# Altium schematic sheet ISO_CAN2.SchDoc
size A4; SheetNumber: 5; SheetTotal: 6
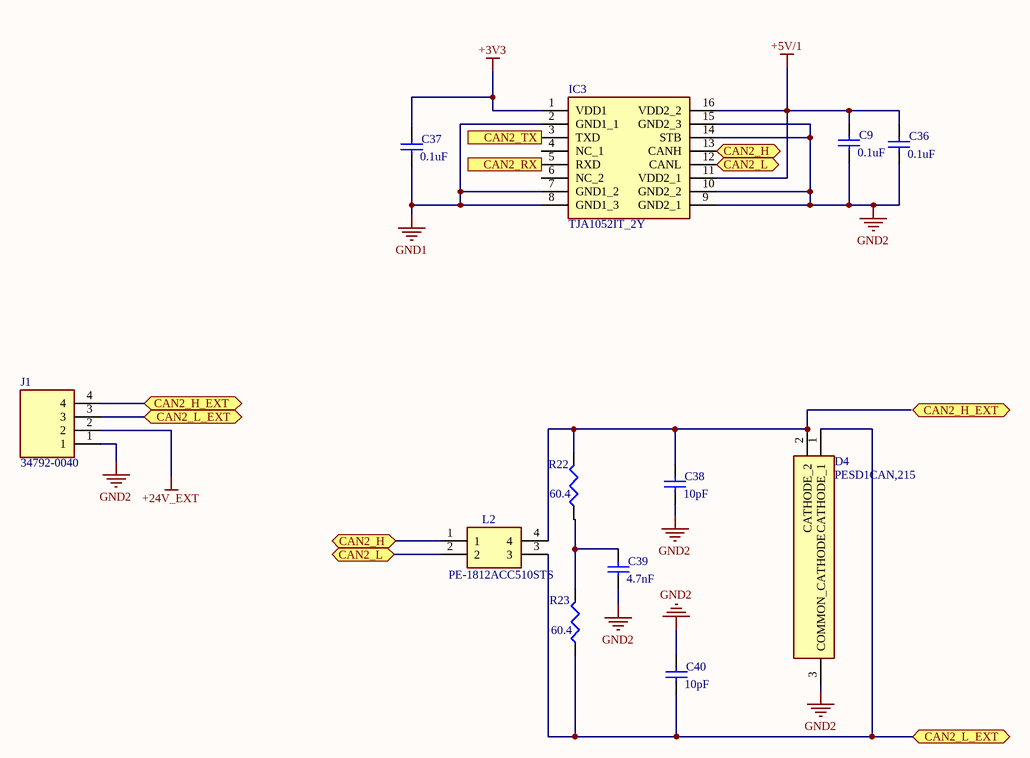
[diagram p0: ISO_CAN2.SchDoc]

## Parts
C9  value 0.1uF  [1608[0603]]  (hidden comment: Cap Semi)
C36  value 0.1uF  [1608[0603]]  (hidden comment: Cap Semi)
C37  value 0.1uF  [1608[0603]]  (hidden comment: Cap Semi)
C38  value 10pF  [1608[0603]]  (hidden comment: Cap Semi)
C39  value 4.7nF  [1608[0603]]  (hidden comment: Cap Semi)
C40  value 10pF  [1608[0603]]  (hidden comment: Cap Semi)
D4  PESD1CAN,215  [SOT95P230X110-3N]
IC3  TJA1052IT_2Y  [SOIC127P1032X265-16N]
J1  34792-0040  [347920040]
L2  PE-1812ACC510STS  [PE1812ACC510STS]
R22  value 60.4  [J1-0603]  (hidden comment: Res3)
R23  value 60.4  [J1-0603]  (hidden comment: Res3)

## Ports
CAN2_H (bidir), CAN2_H_EXT (bidir), CAN2_L (bidir), CAN2_L_EXT (bidir), CAN2_RX (out), CAN2_TX (in)

## Nets
+3V3: C37.2 IC3.1(VDD1)
+5V/1: C9.2 C36.2 IC3.11(VDD2_1) IC3.16(VDD2_2)
+24V_EXT: J1.2
GND1: C37.1 IC3.2(GND1_1) IC3.7(GND1_2) IC3.8(GND1_3)
GND2: C9.1 C36.1 C38.1 C39.1 C40.2 D4.3(COMMON_CATHODE) IC3.9(GND2_1) IC3.10(GND2_2) IC3.14(STB) IC3.15(GND2_3) J1.1
CAN2_H: IC3.13(CANH) L2.1 ; port CAN2_H
CAN2_H_EXT: J1.4 ; port CAN2_H_EXT
CAN2_L: IC3.12(CANL) L2.2 ; port CAN2_L
CAN2_L_EXT: C40.1 D4.1(CATHODE_1) J1.3 L2.3 R23.1 ; port CAN2_L_EXT
CAN2_RX: IC3.5(RXD) ; port CAN2_RX
CAN2_TX: IC3.3(TXD) ; port CAN2_TX
NetC38_2: C38.2 D4.2(CATHODE_2) L2.4 R22.2
NetC39_2: C39.2 R22.1 R23.2

Not connected (* = marked no-connect by the designer): IC3 4(NC_1) 6(NC_2)

## Library data of the parts
C9 C36-C40 = Cap Semi: Capacitor (Semiconductor SIM Model); Published: 8-Jun-2000; LatestRevisionDate: 29-May-2009; LatestRevisionNote: IPC-7351 Footprint Added.; PackageReference: C1206; Publisher: Altium Limited; PackageDescription: Chip Capacitor
D4 = PESD1CAN,215: Diode ESD (Uni-directional); Manufacturer_Name: Nexperia; Datasheet Link: https://assets.nexperia.com/documents/data-sheet/PESD1CAN.pdf; Height: 1.1mm; Manufacturer_Part_Number: PESD1CAN,215; Mouser Part Number: 771-PESD1CAN-T/R; Mouser Price/Stock: https://www.mouser.co.uk/ProductDetail/Nexperia/PESD1CAN215?qs=LOCUfHb8d9vzREMT8aTFcw%3D%3D; Arrow Part Number: PESD1CAN,215; Arrow Price/Stock: https://www.arrow.com/en/products/pesd1can215/nexperia
IC3 = TJA1052IT_2Y: Integrated Circuit; Manufacturer_Name: NXP; Manufacturer_Part_Number: TJA1052IT/2Y; Datasheet Link: http://www.nxp.com/docs/en/data-sheet/TJA1052I.pdf; Height: 2.65mm; Mouser Part Number: 771-TJA1052IT/2Y; Mouser Price/Stock: https://www.mouser.co.uk/ProductDetail/NXP-Semiconductors/TJA1052IT-2Y?qs=5XOdhvmYM0NQslmwDgd7fw%3D%3D; Arrow Part Number: TJA1052IT/2Y; Arrow Price/Stock: https://www.arrow.com/en/products/tja1052it2y/nxp-semiconductors
J1 = 34792-0040: Connector; Manufacturer_Name: Molex; Datasheet Link: https://componentsearchengine.com/Datasheets/2/34792-0040.pdf; Height: 14.6mm; Manufacturer_Part_Number: 34792-0040; Mouser Part Number: 538-34792-0040; Mouser Price/Stock: https://www.mouser.co.uk/ProductDetail/Molex/34792-0040?qs=rBzrYveeBvGu5%2FZeCi%2F%252BbA%3D%3D
L2 = PE-1812ACC510STS: Inductor; Manufacturer_Name: Pulse; Datasheet Link: https://productfinder.pulseeng.com/doc_type/WEB301/doc_num/W717/doc_part/W717.pdf; Height: 3mm; Manufacturer_Part_Number: PE-1812ACC510STS; Mouser Part Number: 673-PE-1812ACC510STS; Mouser Price/Stock: https://www.mouser.co.uk/ProductDetail/Pulse-Electronics/PE-1812ACC510STS?qs=ar8LaIfZsbGrh9tcPYNGNA%3D%3D; Arrow Part Number: PE-1812ACC510STS; Arrow Price/Stock: https://www.arrow.com/en/products/pe-1812acc510sts/pulse-electronics-corporation
R22 R23 = Res3: Resistor; Published: 8-Jun-2000; LatestRevisionDate: 29-May-2009; LatestRevisionNote: IPC-7351 Footprint Added.; PackageReference: J1-0603; Publisher: Altium Limited; PackageDescription: Chip Resistor